# Altium schematic sheet KeypadCapacitive.SchDoc
size A4
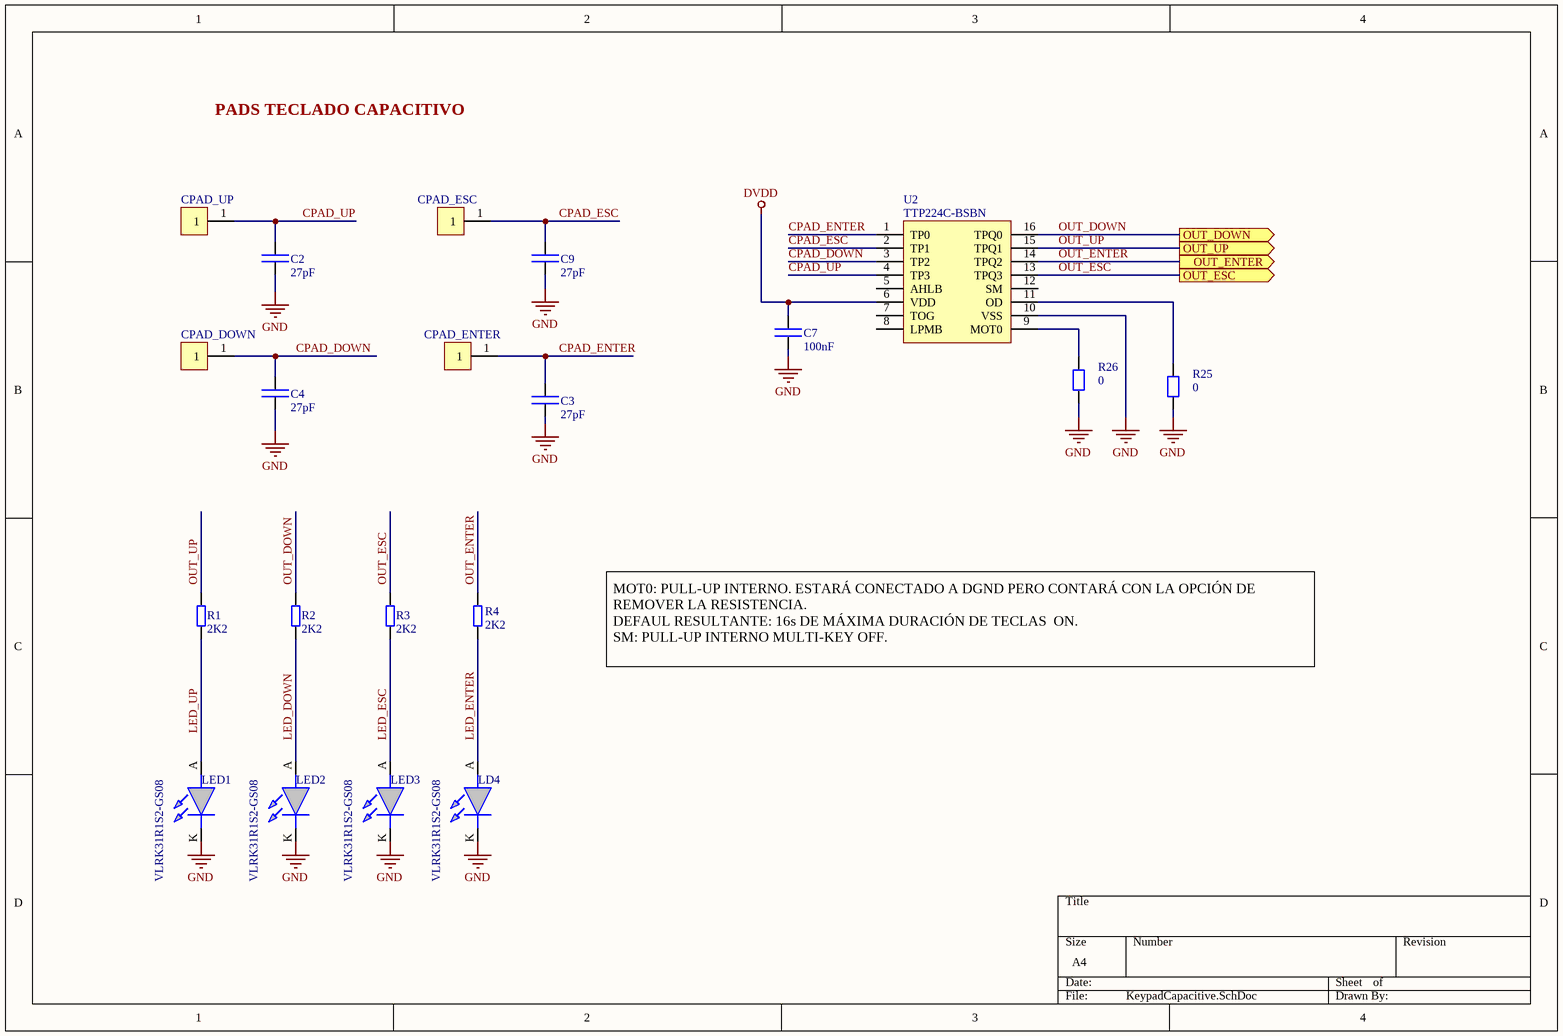
[diagram p0: KeypadCapacitive.SchDoc]

## Parts
C2  27pF  [CAP_SM0603_YAGEOCC2_N]
C3  27pF  [CAP_SM0603_YAGEOCC2_N]
C4  27pF  [CAP_SM0603_YAGEOCC2_N]
C7  100nF  [CAP_SM0603_YAGEOCC2_N]
C9  27pF  [CAP_SM0603_YAGEOCC2_N]
CPAD_DOWN  DOWN  [CAPACITIVE_PAD_12MM]  (value not drawn)  (no BOM)
CPAD_ENTER  ENTER  [CAPACITIVE_PAD_12MM]  (value not drawn)  (no BOM)
CPAD_ESC  ESC  [CAPACITIVE_PAD_12MM]  (value not drawn)  (no BOM)
CPAD_UP  UP  [CAPACITIVE_PAD_12MM]  (value not drawn)  (no BOM)
LD4  VLRK31R1S2-GS08  [VLRK31R1S2GS08]
LED1  VLRK31R1S2-GS08  [VLRK31R1S2GS08]
LED2  VLRK31R1S2-GS08  [VLRK31R1S2GS08]
LED3  VLRK31R1S2-GS08  [VLRK31R1S2GS08]
R1  2K2  [RES_SM0603_YAGEORC_N]
R2  2K2  [RES_SM0603_YAGEORC_N]
R3  2K2  [RES_SM0603_YAGEORC_N]
R4  2K2  [RES_SM0603_YAGEORC_N]
R25  0  [RES_SM0603_YAGEORC_N]
R26  0  [RES_SM0603_YAGEORC_N]
U2  TTP224C-BSBN  [SSOP-16]

## Ports
OUT_DOWN (out), OUT_ENTER (out), OUT_ESC (out), OUT_UP (out)

## Nets
DVDD: C7.2 U2.6(VDD)
GND: C2.1 C3.1 C4.1 C7.1 C9.1 LD4.K LED1.K LED2.K LED3.K R25.1 R26.1 U2.10(VSS)
CPAD_DOWN: C4.2 CPAD_DOWN.1 U2.3(TP2)
CPAD_ENTER: C3.2 CPAD_ENTER.1 U2.1(TP0)
CPAD_ESC: C9.2 CPAD_ESC.1 U2.2(TP1)
CPAD_UP: C2.2 CPAD_UP.1 U2.4(TP3)
LED_DOWN: LED2.A R2.1
LED_ENTER: LD4.A R4.1
LED_ESC: LED3.A R3.1
LED_UP: LED1.A R1.1
OUT_DOWN: R2.2 U2.16(TPQ0) ; port OUT_DOWN
OUT_ENTER: R4.2 U2.14(TPQ2) ; port OUT_ENTER
OUT_ESC: R3.2 U2.13(TPQ3) ; port OUT_ESC
OUT_UP: R1.2 U2.15(TPQ1) ; port OUT_UP
NetR25_2: R25.2 U2.11(OD)
NetR26_2: R26.2 U2.9(MOT0)

Not connected (* = marked no-connect by the designer): U2 5(AHLB) 7(TOG) 8(LPMB) 12(SM)

## Notes on the sheet
- PADS TECLADO CAPACITIVO
- MOT0: PULL-UP INTERNO. ESTARÁ CONECTADO A DGND PERO CONTARÁ CON LA OPCIÓN DE REMOVER LA RESISTENCIA.
  DEFAUL RESULTANTE: 16s DE MÁXIMA DURACIÓN DE TECLAS  ON.
  SM: PULL-UP INTERNO MULTI-KEY OFF.

## Library data of the parts
C2-C4 C9 = CC0603JRNPO9BN270: CAP 27pF SM0603 NPO 50V YAGEO CC2; Tolerance (%): 5; Voltage Rating (Volts): 50; Package: 0603; Manufacturer: Yageo; ComponentLink1Description: Manufacturer Website; ComponentLink1URL: http://www.yageo.com; Value: 27pF; Category: Capacitor; Manufacturer Part Number: CC0603JRNPO9BN270; Supplier Part Number 1: 722017; Supplier 1: Farnell; Supplier 2: Digi-Key; Supplier Part Number 2: 311-1063-1-ND
C7 = CC0603KRX7R9BB104: CAP 100nF SM0603 X7R 50V YAGEO CC2; Tolerance (%): 10; Voltage Rating (Volts): 50; Package: 0603; Manufacturer: Yageo; ComponentLink1Description: Manufacturer Website; ComponentLink1URL: http://www.yageo.com; Value: 100nF; Category: Capacitor; Manufacturer Part Number: CC0603KRX7R9BB104; Supplier Part Number 1: 1362556; Supplier 1: Farnell; Supplier 2: Digi-Key; Supplier Part Number 2: 311-1344-1-ND; Datasheet: https://datasheet.lcsc.com/lcsc/2211101700_YAGEO-CC0603KRX7R9BB104_C14663.pdf
CPAD_DOWN CPAD_ENTER CPAD_ESC CPAD_UP = CAPACITIVE_PAD_12MM: CHN-Manufacturer PartNumber: H146; CHN-Unit Price: $0.7300; Type: thru-hole; ComponentLink1Description: AliExpress; ComponentLink1URL: https://es.aliexpress.com/item/1005004527423869.html?spm=a2g0o.detail.1000014.16.502e32205VZBuG&gps-id=pcDetailBottomMoreOtherSeller&scm=1007.40000.267768.0&scm_id=1007.40000.267768.0&scm-url=1007.40000.267768.0&pvid=72c520e2-f2a8-461d-97e7-b7d30736c04e&_t=gps-id:pcDetailBottomMoreOtherSeller,scm-url:1007.40000.267768.0,pvid:72c520e2-f2a8-461d-97e7-b7d30736c04e,tpp_buckets:668%232846%238110%23313&pdp_ext_f=%7B%22sku_id%22%3A%2212000029483215674%22%2C%22sceneId%22%3A%2230050%22%7D&pdp_npi=2%40dis%21ARS%2160.66%2154.6%21%21%21%21%21%40210323a216660255258725316e1a7a%2112000029483215674%21rec
LD4 LED1-LED3 = VLRK31R1S2-GS08: Red 630nm LED Indication - Discrete 2.1V 2-SMD, Z-Bend; Manufacturer: Vishay; Manufacturer Part Number: VLRK31R1S2-GS08
R1-R4 = RC0603FR-072K2L: RES 2K2 SM0603 YAGEO RC_L; Power (Watts): 0.1; Resistance (Ohms): 2200; Tolerance (%): 1; Category: Resistor; Manufacturer: Yageo; Manufacturer Part Number: RC0603FR-072K2L; Package: 0603; Value: 2K2; Supplier Part Number 1: 9238522; Supplier 1: Farnell; ComponentLink1Description: Manufacturer Website; ComponentLink1URL: http://www.yageo.com; Supplier 2: Digi-Key; Supplier Part Number 2: 311-2.20KHRCT-ND
R25 R26 = RC0603FR-070RL: RES 0 OHMS SM0603 YAGEO RC_L; Power (Watts): 0.1; Tolerance (%): 1; Package: 0603; Manufacturer: Yageo; ComponentLink1Description: Manufacturer Website; ComponentLink1URL: http://www.yageo.com; Value: 0; Category: Resistor; Manufacturer Part Number: RC0603FR-070RL; Resistance (Ohms): 0; Supplier Part Number 1: 9238484; Supplier 1: Farnell; Supplier 2: Digi-Key; Supplier Part Number 2: 311-1.00KHRCT-ND; Datasheet: https://www.yageo.com/upload/media/product/app/datasheet/rchip/pyu-rc_group_51_rohs_l.pdf
U2 = TTP224C-BSBN: SSOP-16 Touch Screen Controllers ROHS; Manufacturer: Tontek Design Tech; Vendor Part Number: C2890350; Vendor: LCSC; Manufacturer Part Number: TTP224C-BSBN; Price: 0.2692